# EasyEDA schematic Booster_wire_schematic.json

## Sheets
1 Booster with net port: TITLE: Sheet_1; REV: 1.0; Date: 2026-05-02; Sheet: 1/1; Drawn By: levonnkarapetyan; Company: Your Company
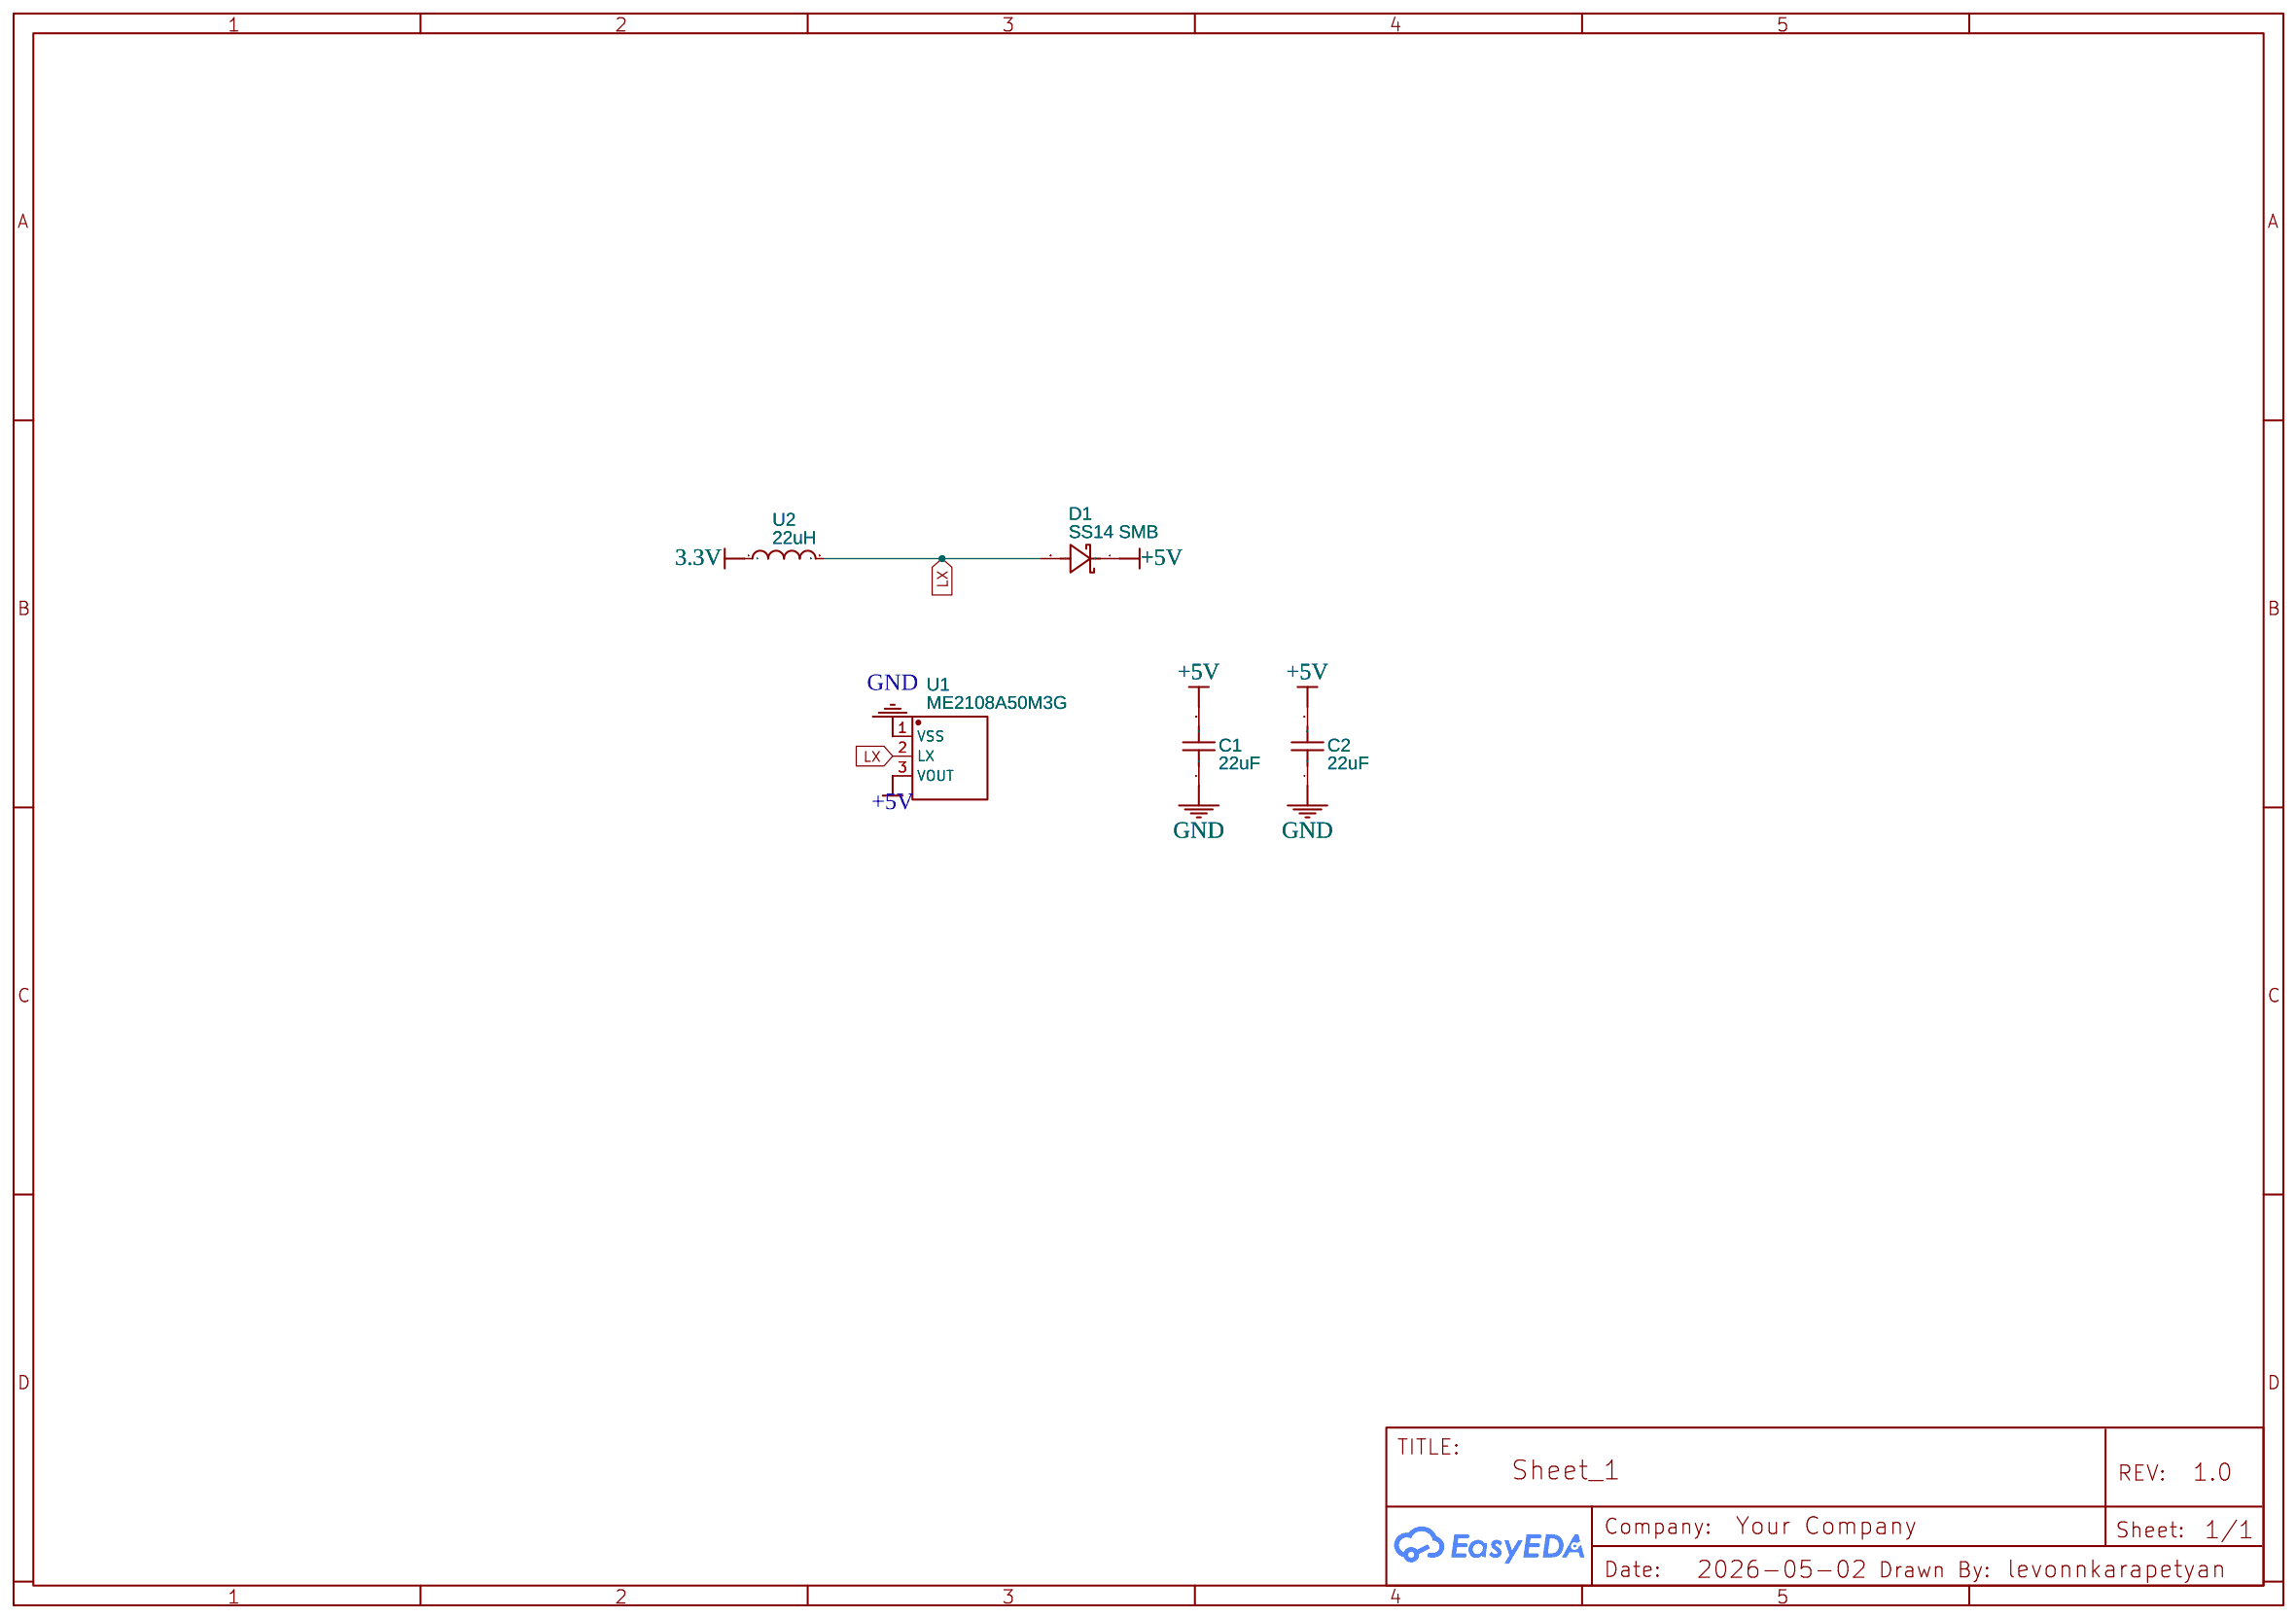
[diagram p0: Booster with net port]
2 Booster with wire: TITLE: Sheet_2
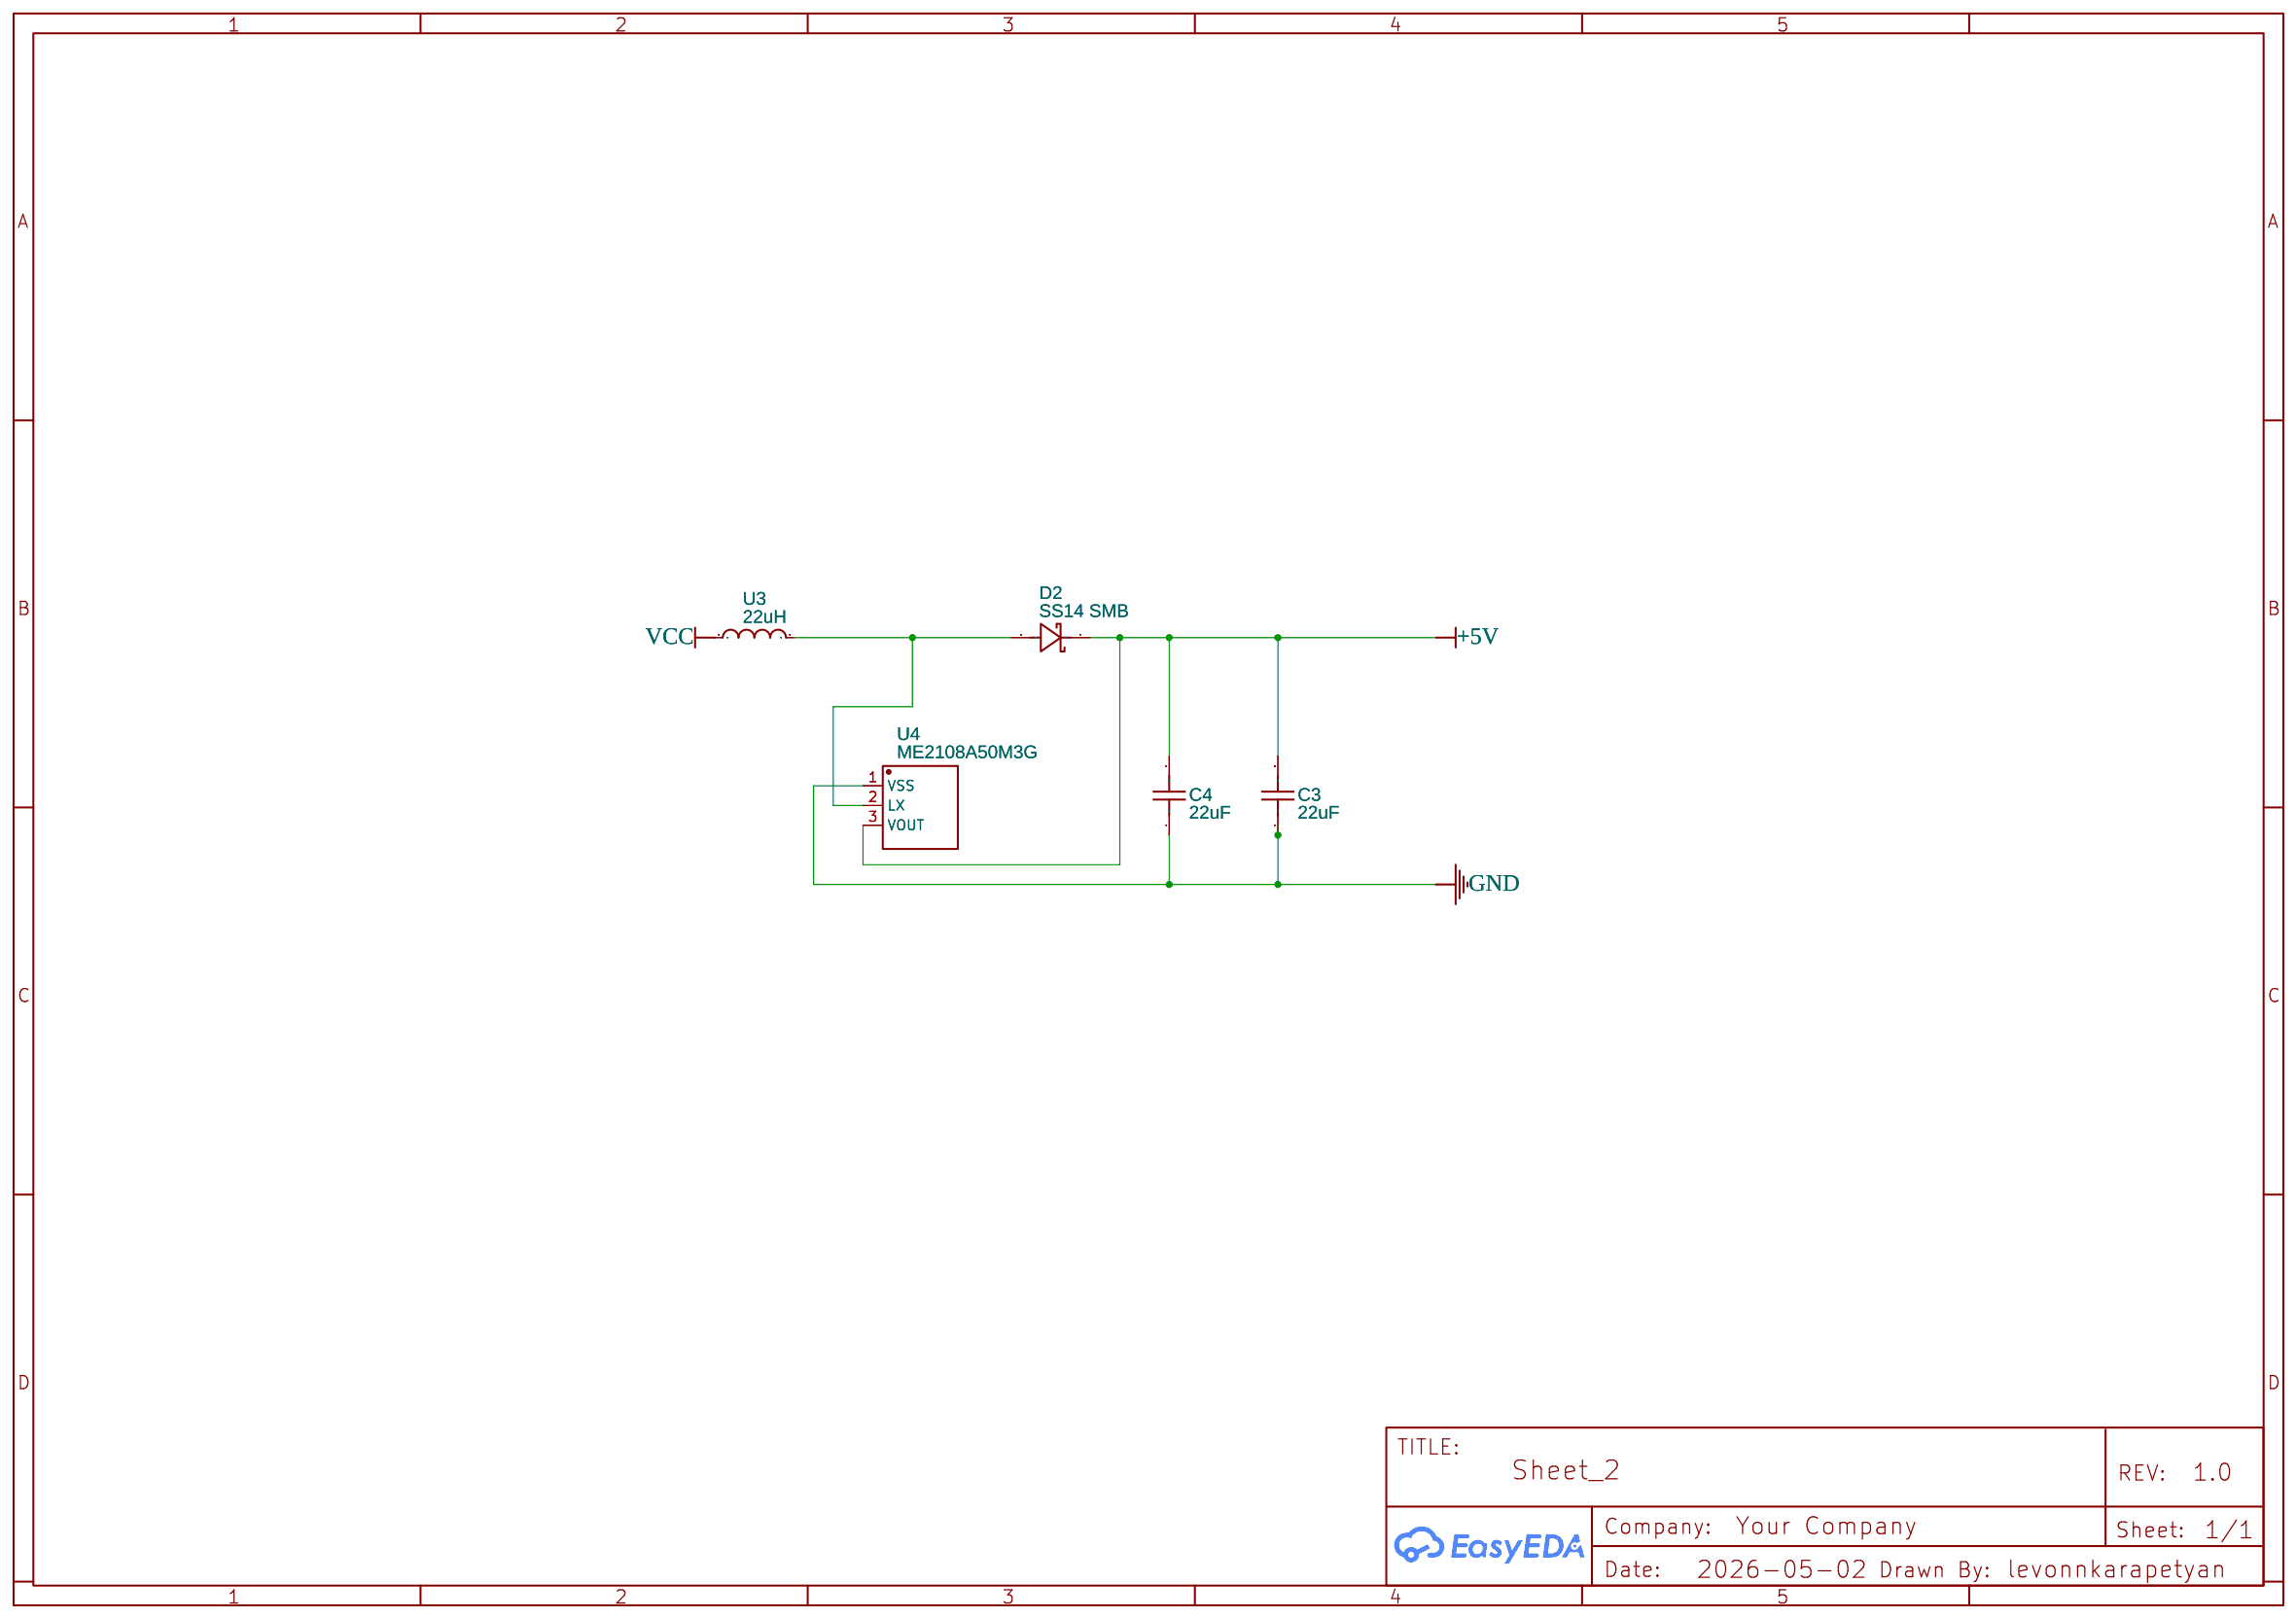
[diagram p1: Booster with wire]

## Parts
sheet Booster with net port
C1  22uF  [C0805]
C2  22uF  [C0805]
D1  SS14 SMB  [DO-214AC_L4.3-W3.6-LS5.3-RD]
U1  ME2108A50M3G  [SOT-23-3_L2.9-W1.3-P1.90-LS2.4-BR]
U2  22uH  [IND-SMD_L7.1-W6.6]
sheet Booster with wire
C3  22uF  [C0805]
C4  22uF  [C0805]
D2  SS14 SMB  [DO-214AC_L4.3-W3.6-LS5.3-RD]
U3  22uH  [IND-SMD_L7.1-W6.6]
U4  ME2108A50M3G  [SOT-23-3_L2.9-W1.3-P1.90-LS2.4-BR]

## Library data of the parts
C1-C4 = CL21A226MAYNNNE: Contributor: LCSC; Supplier: LCSC; Supplier Part: C602037; Manufacturer: SAMSUNG(三星); JLCPCB Part Class: Extended Part
D1 D2 = SS14 SMB: Contributor: LCSC; Supplier: LCSC; Supplier Part: C920329; Manufacturer: BORN(伯恩半导体); JLCPCB Part Class: Extended Part
U1 U4 = ME2108A50M3G: Supplier: LCSC; Manufacturer: MICRONE(南京微盟); Supplier Part: C14839; JLCPCB Part Class: Extended Part
U2 U3 = APH0630T220M: Supplier: LCSC; Supplier Part: C5349702; Manufacturer: APV(爱普微); JLCPCB Part Class: Extended Part; Contributor: lcsc

## Nets
3.3V: U2.1
+5V: C1.2 C2.2 C3.2 C4.2 D1.1(K) D2.1(K) U1.3(VOUT) U4.3(VOUT)
GND: C1.1 C2.1 C3.1 C4.1 U1.1(VSS) U4.1(VSS)
VCC: U3.1
LX: D1.2(A) U1.2(LX) U2.2
Net-(D2-2): D2.2(A) U3.2 U4.2(LX)
